# Altium project SwarmBots.PrjPcb
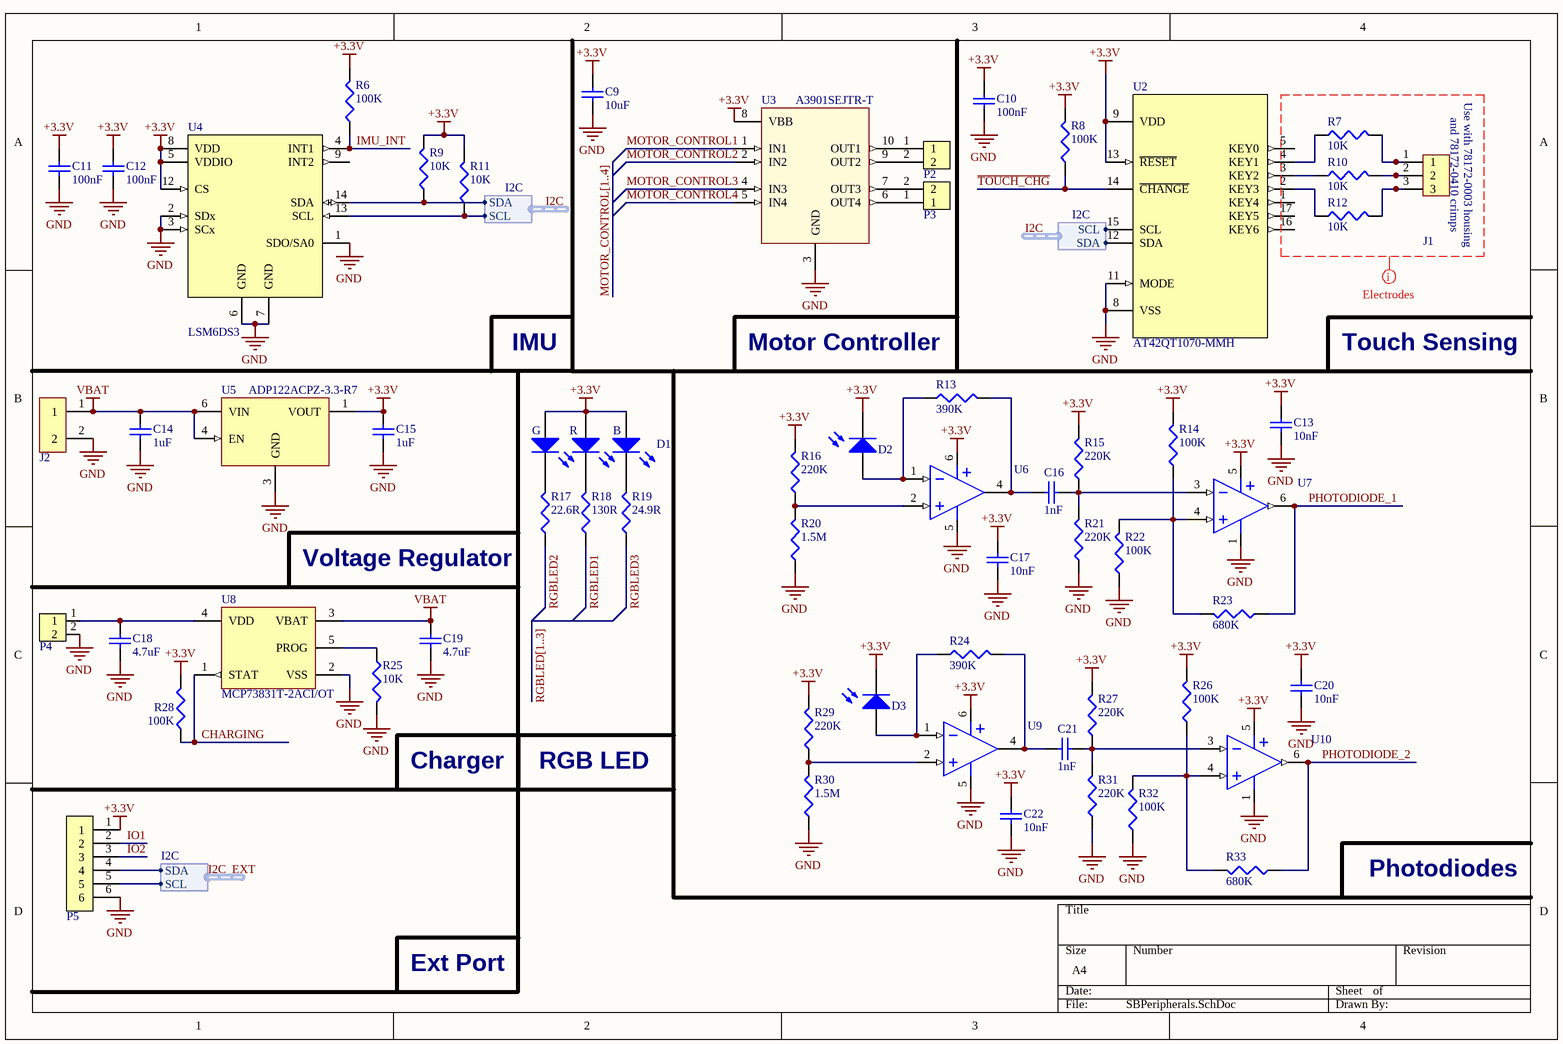
[diagram p0: SBPeripherals.SchDoc]
2 sheets, 73 parts. Net scope: global (net labels, ports and power ports of the same name join across sheets).
Board file: SwarmBots.PcbDoc
Sheets:
  SBPeripherals.SchDoc
  SBRadio.SchDoc

## Sheet SBPeripherals.SchDoc
size A4

### Parts
C9  10uF  [0603]
C10  100nF  [0402]
C11  100nF  [0402]
C12  100nF  [0402]
C13  10nF  [0402]
C14  1uF  [0603]
C15  1uF  [0603]
C16  1nF  [0402]
C17  10nF  [0402]
C18  4.7uF  [0603]
C19  4.7uF  [0603]
C20  10nF  [0402]
C21  1nF  [0402]
C22  10nF  [0402]
D1  SMLVN6RGB1W1  [3.5x2.8 mm 6-SMD]  (value not drawn)
D2  PD15-22C/TR8  [PD15-22C/TR8]  (value not drawn)
D3  PD15-22C/TR8  [PD15-22C/TR8]  (value not drawn)
J1  78171-0003  [78171-0003]  (value not drawn)
J2  78171-0002  [78171-0002]  (value not drawn)
P2  HEADER 2X1 0.05" UNPOLARIZED  [HEADER 2X1 0.05" - UNPOLARIZED]  (value not drawn)
P3  HEADER 2X1 0.05" UNPOLARIZED  [HEADER 2X1 0.05" - UNPOLARIZED]  (value not drawn)
P4  CHARGING PAD  [Charging Pad]  (value not drawn)
P5  EXTENSION_PORT  [EXTENSION_PORT]  (value not drawn)
R6  100K  [0402]
R7  10K  [0402]
R8  100K  [0402]
R9  10K  [0402]
R10  10K  [0402]
R11  10K  [0402]
R12  10K  [0402]
R13  390K  [0402]
R14  100K  [0402]
R15  220K  [0402]
R16  220K  [0402]
R17  22.6R  [0402]
R18  130R  [0402]
R19  24.9R  [0402]
R20  1.5M  [0402]
R21  220K  [0402]
R22  100K  [0402]
R23  680K  [0402]
R24  390K  [0402]
R25  10K  [0402]
R26  100K  [0402]
R27  220K  [0402]
R28  100K  [0402]
R29  220K  [0402]
R30  1.5M  [0402]
R31  220K  [0402]
R32  100K  [0402]
R33  680K  [0402]
U2  AT42QT1070-MMH  [QFN45P300X300X85_HS-21L]
U3  A3901SEJTR-T  [DFN50P300X300X75_HS-11N]
U4  LSM6DS3  [LGA-14 2.5x3x0.86 mm 14L]
U5  ADP122ACPZ-3.3-R7  [LFCSP-6 2.0X2.0X0.55]
U6  TSV991AIQ1T  [DFN6-1.3x1.6x0.55]  (value not drawn)
U7  NCS2200AMUT1G  [UDFN6-1.2x1.0]  (value not drawn)
U8  MCP73831T-2ACI/OT  [SOT-23-OT5_L]
U9  TSV991AIQ1T  [DFN6-1.3x1.6x0.55]  (value not drawn)
U10  NCS2200AMUT1G  [UDFN6-1.2x1.0]  (value not drawn)

### Harnesses
I2C: SDA, SCL

### Nets
+3.3V: C9.2 C10.2 C11.2 C12.2 C13.2 C15.2 C17.2 C20.2 C22.2 D1.1(AB) D1.2(AR) D1.3(AG) D2.2(K) D3.2(K) P5.1 R6.2 R8.2 R9.2 R11.2 R14.2 R15.2 R16.2 R26.2 R27.2 R28.2 R29.2 U2.9(VDD) U2.13(~{RESET}) U3.8(VBB) U4.5(VDDIO) U4.8(VDD) U4.12(CS) U5.1(VOUT) U6.6(VCC) U7.5(VCC) U9.6(VCC) U10.5(VCC)
GND: C9.1 C10.1 C11.1 C12.1 C13.1 C14.1 C15.1 C17.1 C18.1 C19.1 C20.1 C22.1 J2.2 P4.2 P5.6 R20.1 R21.1 R22.1 R25.2 R30.1 R31.1 R32.1 U2.8(VSS) U2.11(MODE) U2.21(PAD) U3.3(GND) U3.11(PAD) U4.1(SDO/SA0) U4.2(SDx) U4.3(SCx) U4.6(GND) U4.7(GND) U5.2(NC) U5.3(GND) U5.5(NC) U5.7(THPAD) U6.5(GND) U7.1(GND) U8.2(VSS) U9.5(GND) U10.1(GND)
VBAT: C14.2 C19.2 J2.1 U5.4(EN) U5.6(VIN) U8.3(VBAT)
CHARGING: R28.1 U8.1(STAT)
I2C.SCL: R11.1 U2.15(SCL) U4.13(SCL) ; harness I2C.SCL
I2C.SDA: R9.1 U2.12(SDA) U4.14(SDA) ; harness I2C.SDA
I2C_EXT.SCL: P5.5 ; harness I2C.SCL
I2C_EXT.SDA: P5.4 ; harness I2C.SDA
IMU_INT: R6.1 U4.4(INT1)
IO1: P5.2
IO2: P5.3
MOTOR_CONTROL1: U3.1(IN1)
MOTOR_CONTROL2: U3.2(IN2)
MOTOR_CONTROL3: U3.4(IN3)
MOTOR_CONTROL4: U3.5(IN4)
PHOTODIODE_1: R23.1 U7.6(OUT)
PHOTODIODE_2: R33.1 U10.6(OUT)
RGBLED1: R18.1
RGBLED2: R17.1
RGBLED3: R19.1
~{TOUCH_CHG}: R8.1 U2.14(~{CHANGE})
NetC16_1: C16.1 R13.2 U6.4(OUT)
NetC16_2: C16.2 R15.1 R21.2 U7.3(IN-)
NetC18_2: C18.2 P4.1 U8.4(VDD)
NetC21_1: C21.1 R24.2 U9.4(OUT)
NetC21_2: C21.2 R27.1 R31.2 U10.3(IN-)
NetD1_4: D1.4(KG) R17.2
NetD1_5: D1.5(KR) R18.2
NetD1_6: D1.6(KB) R19.2
NetD2_1: D2.1(A) R13.1 U6.1(IN-)
NetD3_1: D3.1(A) R24.1 U9.1(IN-)
NetJ1_1: J1.1 R7.2
NetJ1_2: J1.2 R10.2
NetJ1_3: J1.3 R12.2
NetP2_1: P2.1 U3.10(OUT1)
NetP2_2: P2.2 U3.9(OUT2)
NetP3_1: P3.1 U3.6(OUT4)
NetP3_2: P3.2 U3.7(OUT3)
NetR7_1: R7.1 U2.4(KEY1)
NetR10_1: R10.1 U2.3(KEY2)
NetR12_1: R12.1 U2.2(KEY3)
NetR14_1: R14.1 R22.2 R23.2 U7.4(IN+)
NetR16_1: R16.1 R20.2 U6.2(IN+)
NetR25_1: R25.1 U8.5(PROG)
NetR26_1: R26.1 R32.2 R33.2 U10.4(IN+)
NetR29_1: R29.1 R30.2 U9.2(IN+)

Not connected (* = marked no-connect by the designer): U2 1(KEY4) 5(KEY0) 6(NC) 7(NC) 10(NC) 16(KEY6) 17(KEY5) 18(NC) 19(NC) 20(NC); U4 9(INT2) 10(OCS) 11(NC)

### Buses and harness runs
bus MOTOR_CONTROL[1..4]
bus RGBLED[1..3]

### Layout directives
net class Electrodes: (no net found under the mark)

### Notes on the sheet
- IMU
- (near R13) Motor Controller
- Touch Sensing
- Voltage Regulator
- Charger
- RGB LED
- Photodiodes
- Ext Port
- (in symbol 78171-0003) and 78172-0410 crimps; Use with 78172-0003 housing
- (in symbol SMLVN6RGB1W1) G; R; B

### Library data of the parts
C9 = 10uF: 10uF 0603 X5R 6.3V ±20%; Supplier 1: Farnell; Supplier Part Number 1: 2456110; Supplier 2: Digi-Key; Supplier Part Number 2: 490-10475-1-ND; Value: 10uF
C10-C12 = 100nF: 100nF 0402 X7R 16V ±10%; Supplier 1: Farnell; Supplier Part Number 1: 1288252; Supplier 2: Digi-Key; Supplier Part Number 2: 399-3521-1-ND; Value: 100nF
C13 C17 C20 C22 = 10nF: 10nF 0402 X7R 25V ±5%; Supplier 1: Farnell; Supplier Part Number 1: 1692285; Supplier 2: Digi-Key; Supplier Part Number 2: 399-1279-1-ND; Value: 10nF
C14 C15 = 1uF: 1uF 0603 X5R 10V ±10%; Supplier 1: Farnell; Supplier Part Number 1: 1759399; Supplier 2: Digi-Key; Supplier Part Number 2: 478-1251-1-ND; Value: 1uF
C16 C21 = 1nF: 1nF 0402 X7R 50V ±10%; Supplier 1: Farnell; Supplier 2: Digi-Key; Supplier Part Number 1: 1414573; Supplier Part Number 2: 399-1032-1-ND; Value: 1nF
C18 C19 = 4.7uF: 4.7uF 0603 X5R 10V ±10%; Supplier 1: Farnell; Supplier Part Number 1: 2362098; Supplier 2: Digi-Key; Supplier Part Number 2: 445-5170-1-ND; Value: 4.7uF
D1 = SMLVN6RGB1W1: ROHM SMLVN6RGB1W1 LED Tri-Color Blue/Green/Red Chip LED 6-Pin 1411 T/RLED Tri-Color Blue/Green/Red Chip LED 6-Pin 1411; Supplier 1: Mouser; Supplier 2: Digi-Key; Supplier Part Number 1: 755-SMLVN6RGB1W1; Supplier Part Number 2: 846-1187-1-ND
D2 D3 = PD15-22C/TR8: Everlight PD15-22C/TR8 Silicon PIN Photodiode; Supplier 1: Digi-Key; Supplier Part Number 1: 1080-1367-1-ND
J1 = 78171-0003: Molex Pico-EZmate™ Wire-to-Board Header, 3 contacts; Supplier 1: Farnell; Supplier 2: Digi-Key; Supplier Part Number 1: 2313562; Supplier Part Number 2: WM5409CT-ND
J2 = 78171-0002: Molex Pico-EZmate™ Wire-to-Board Header, 2 contacts; Supplier 1: Farnell; Supplier 2: Digi-Key; Supplier Part Number 1: 2313710; Supplier Part Number 2: WM4459CT-ND
R6 R8 R14 R22 R26 R28 R32 = 100K: 100K 0402 1/16W ±1%; Supplier 1: Farnell; Supplier Part Number 1: 2072519; Supplier 2: Digi-Key; Supplier Part Number 2: 541-100KLCT-ND; Value: 100K
R7 R9-R12 R25 = 10K: 10K 0402 1/16W ±1%; Supplier 1: Farnell; Supplier Part Number 1: 2072517; Supplier 2: Digi-Key; Supplier Part Number 2: 541-10.0KLCT-ND; Value: 10K
R13 R24 = 390K: 390K 0402 1/16W ±1%; Supplier 1: Farnell; Supplier 2: Digi-Key; Supplier Part Number 1: 2302905; Supplier Part Number 2: P390KLCT-ND; Supplier 3: Mouser; Supplier Part Number 3: 667-ERJ-2RKF3903X; Value: 390K
R15 R16 R21 R27 R29 R31 = 220K: 220K 0402 1/16W ±1%; Supplier 1: Farnell; Supplier 2: Digi-Key; Supplier Part Number 1: 9239510; Supplier Part Number 2: 311-220KLRCT-ND; Supplier 3: Mouser; Supplier Part Number 3: 603-RC0402FR-07220KL; Value: 220K
R17 = 22.6R: 22.6R 0402 1/16W ±0.05R; Supplier 1: Farnell; Supplier 2: Digi-Key; Supplier Part Number 1: 2302454; Supplier Part Number 2: P22.6LCT-ND; Value: 22.6R
R18 = 130R: 130R 0402 1/16W ±0.05R; Supplier 1: Farnell; Supplier 2: Digi-Key; Supplier Part Number 1: 2059115; Supplier Part Number 2: P130LCT-ND; Value: 130R
R19 = 24.9R: 24.9R 0402 1/16W ±0.05R; Supplier 1: Farnell; Supplier 2: Digi-Key; Supplier Part Number 1: 2059102; Supplier Part Number 2: P24.9LCT-ND; Value: 24.9R
R20 R30 = 1.5M: 1.5M 0402 1/16W ±1%; Supplier 1: Farnell; Supplier Part Number 1: 2141473; Supplier 2: Digi-Key; Supplier Part Number 2: 541-1.50MLCT-ND; Value: 1.5M
R23 R33 = 680K: 680K 0402 1/16W ±1%; Supplier 1: Farnell; Supplier 2: Digi-Key; Supplier Part Number 1: 2302935; Supplier Part Number 2: P680KLCT-ND; Supplier 3: Mouser; Supplier Part Number 3: 667-ERJ-2RKF6803X; Value: 680K
U2 = AT42QT1070-MMH: Atmel Seven-channel QTouch® Touch Sensor IC; Supplier 1: Digi-Key; Supplier Part Number 1: AT42QT1070-MMHCT-ND
U3 = A3901SEJTR-T: ALLEGRO MICROSYSTEMS - A3901SEJTR-T - IC, MOTOR DRIVER; Supplier 1: Farnell; Supplier 2: Digi-Key; Supplier Part Number 1: 1651947; Supplier Part Number 2: 620-1159-1-ND
U4 = LSM6DS3: STMicroelectronics iNEMO inertial module:   3D accelerometer and 3D gyroscope; Supplier 1: Farnell; Supplier Part Number 1: 2474253; Supplier 2: Digi-Key; Supplier Part Number 2: 497-15383-1-ND
U5 = ADP122ACPZ-3.3-R7: Analog Devices ADP122ACPZ-3.3-R7 - 5.5 V Input, 300 mA, Low Quiescent  Current, CMOS Linear Regulator; Supplier 1: Farnell; Supplier 2: Digi-Key; Supplier Part Number 1: 2457164; Supplier Part Number 2: ADP122ACPZ-3.3-R7CT-ND
U6 U9 = TSV991AIQ1T: ST TSV991AIQ1T Rail-to-rail input/output 20 MHz GBP opamp; Supplier 1: Mouser; Supplier 2: Digi-Key; Supplier Part Number 1: 511-TSV991AIQ1T; Supplier Part Number 2: 497-15999-1-ND
U7 U10 = NCS2200AMUT1G: Low Voltage Comparator; Supplier 1: Farnell; Supplier 2: Mouser; Supplier 3: Digi-Key; Supplier Part Number 1: 1369752; Supplier Part Number 2: 863-NCS2200AMUT1G; Supplier Part Number 3: NCS2200AMUT1GOSCT-ND
U8 = MCP73831T-2ACI/OT: Miniature Single-Cell, Fully Integrated Li-Ion, Li-Polymer Charge Management Controller, 4.2V, 5-Pin SOT-23, Industrial Temperature, Tape and Reel; Published: 29-Jan-2009; LatestRevisionDate: 27-Nov-2009; LatestRevisionNote: Updated to datasheet revision E, Sep-2008; DatasheetVersion: revE, Sep-2008; PackageVersion: revBB, Aug-2009; PackageReference: SOT-23-OT5; Publisher: Altium Limited; PackageDescription: 5-Lead Plastic Small Outline Transistor (OT) [SOT-23]; Supplier 1: Farnell; Supplier Part Number 1: 1332158; Code_IPC: SOT23-5; ComponentLink1Description: Datasheet; ComponentLink1URL: http://ww1.microchip.com/downloads/en/DeviceDoc/21984e.pdf; ComponentLink2Description: Packaging Specification; ComponentLink2URL: http://www.microchip.com/stellent/groups/techpub_sg/documents/packagingspec/en012702.pdf; ComponentLink3Description: Microchip.com Home; ComponentLink3URL: http://www.microchip.com/

## Sheet SBRadio.SchDoc
size A4; PageSetup: Record=PageOptions|CenterHorizontal=True|CenterVertical=True|PrintScale=1.00|XCorrection=1.00|YCorrection=1.00|PrintKind=1|BorderSize=5000000|LeftOffset=0|BottomOffset=0|Orientation=2|PaperLength=1000|PaperWidth=1000|Scale=100|PaperSource=7|PrintQuality=-3|MediaType=1|DitherType=10|PrintScaleMode=1|PaperKind=A4|PaperIndex=9
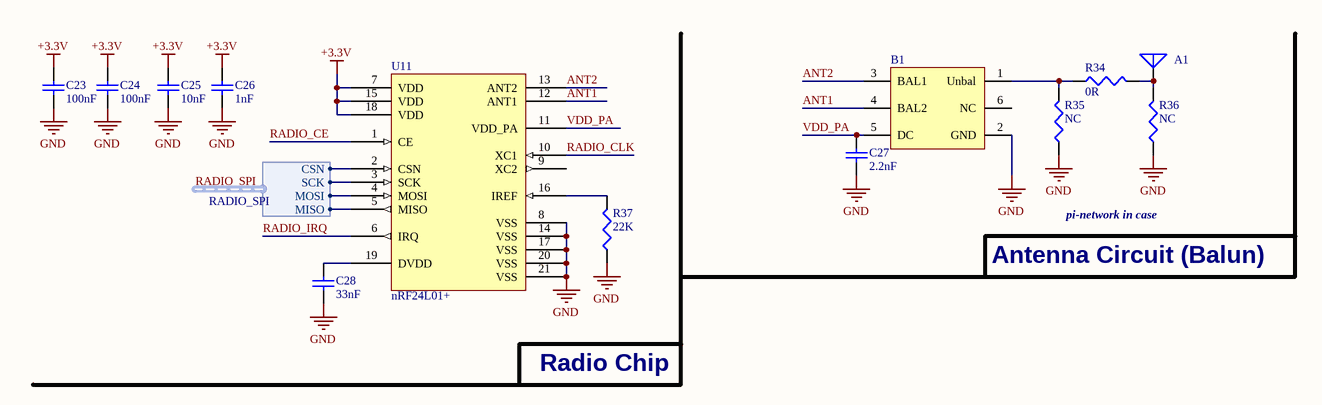
[diagram p1: SBRadio.SchDoc]

### Parts
A1  2450AT18D0100  [2450AT18D0100]  (value not drawn)
B1  2450BM14A0002T  [2450BM14A0002]  (value not drawn)
C23  100nF  [0402]
C24  100nF  [0402]
C25  10nF  [0402]
C26  1nF  [0402]
C27  2.2nF  [0402]
C28  33nF  [0402]
R34  0R  [0402]
R35  value NC  [0402 - NOBODY]  (hidden comment: 0402-NC)
R36  value NC  [0402 - NOBODY]  (hidden comment: 0402-NC)
R37  value 22K  [0402]  (hidden comment: 22K 0402 1/16W ±1%)
U11  nRF24L01+  [QFN50P400X400X95_HS-21L]

### Harnesses
RADIO_SPI: MOSI, MISO, SCK, CSN

### Nets
+3.3V: C23.2 C24.2 C25.2 C26.2 U11.7(VDD) U11.15(VDD) U11.18(VDD)
GND: A1.2(GND) B1.2(GND) C23.1 C24.1 C25.1 C26.1 C27.1 C28.1 R35.1 R36.1 R37.1 U11.8(VSS) U11.14(VSS) U11.17(VSS) U11.20(VSS) U11.21(VSS)
ANT1: B1.4(BAL2) U11.12(ANT1)
ANT2: B1.3(BAL1) U11.13(ANT2)
RADIO_CE: U11.1(CE)
RADIO_CLK: U11.10(XC1)
RADIO_IRQ: U11.6(IRQ)
RADIO_SPI.CSN: U11.2(CSN) ; harness RADIO_SPI.CSN
RADIO_SPI.MISO: U11.5(MISO) ; harness RADIO_SPI.MISO
RADIO_SPI.MOSI: U11.4(MOSI) ; harness RADIO_SPI.MOSI
RADIO_SPI.SCK: U11.3(SCK) ; harness RADIO_SPI.SCK
VDD_PA: B1.5(DC) C27.2 U11.11(VDD_PA)
NetA1_1: A1.1(A) R34.2 R36.2
NetB1_1: B1.1(Unbal) R34.1 R35.2
NetC28_2: C28.2 U11.19(DVDD)
NetR37_2: R37.2 U11.16(IREF)

Not connected (* = marked no-connect by the designer): B1 6(NC); U11 9(XC2)

### Notes on the sheet
- pi-network in case
- Antenna Circuit (Balun)
- Radio Chip

### Library data of the parts
A1 = 2450AT18D0100: JOHANSON TECHNOLOGY 2450AT18D0100  ANTENNA, CERAMIC, 2.45GHZ; Supplier 1: Mouser; Supplier 2: Digi-Key; Supplier Part Number 1: 609-2450AT18D0100E; Supplier Part Number 2: 712-1573-1-ND
B1 = 2450BM14A0002T: Johanson Technology Impedance Matched Balun Filter Integrated Passive for nRF24L01; Supplier 1: Farnell; Supplier 2: Digi-Key; Supplier Part Number 1: 2148533; Supplier Part Number 2: 712-1574-1-ND
C23 C24 = 100nF: 100nF 0402 X7R 16V ±10%; Supplier 1: Farnell; Supplier Part Number 1: 1288252; Supplier 2: Digi-Key; Supplier Part Number 2: 399-3521-1-ND; Value: 100nF
C25 = 10nF: 10nF 0402 X7R 25V ±5%; Supplier 1: Farnell; Supplier Part Number 1: 1692285; Supplier 2: Digi-Key; Supplier Part Number 2: 399-1279-1-ND; Value: 10nF
C26 = 1nF: 1nF 0402 X7R 50V ±10%; Supplier 1: Farnell; Supplier 2: Digi-Key; Supplier Part Number 1: 1414573; Supplier Part Number 2: 399-1032-1-ND; Value: 1nF
C27 = 2.2nF: 2.2nF 0402 X7R 50V ±10%; Supplier 1: Farnell; Supplier 2: Digi-Key; Supplier Part Number 1: 1414582; Supplier Part Number 2: 399-3068-1-ND; Value: 2.2nF
C28 = 33nF: 33nF 0402 X7R 50V ±10%; Supplier 1: Farnell; Supplier 2: Digi-Key; Supplier Part Number 1: 2210826; Supplier Part Number 2: 445-7334-1-ND; Value: 33nF
R34 = 0R: 0R 0402 1/16W ±0.05R; Supplier 1: Farnell; Supplier 2: Digi-Key; Supplier Part Number 1: 2072513; Supplier Part Number 2: P0.0JCT-ND; Value: 0R
R35 R36 = 0402-NC: NOT CONNECTED
R37 = 22K: Supplier 1: Farnell; Supplier 2: Digi-Key; Supplier Part Number 1: 2072781; Supplier Part Number 2: 541-22.0KLCT-ND
U11 = nRF24L01+: Nordic Semi Ultra low power 2.4GHz RF Transceiver IC; Supplier 1: Digi-Key; Supplier Part Number 1: 1490-1033-1-ND

## Nets that join several sheets
+3.3V: SBPeripherals (37 pins), SBRadio (7 pins)
GND: SBPeripherals (41 pins), SBRadio (16 pins)